# Altium schematic sheet 5_dc_dc_3V3_EPS_Beacon.SchDoc: EPS/BCM Step-Down Converter
size A4; DrawnBy: Sara V. Martínez; Engineer: Flight; DocumentNumber: 8; Revision: V0.1; SheetNumber: 8; SheetTotal: 11
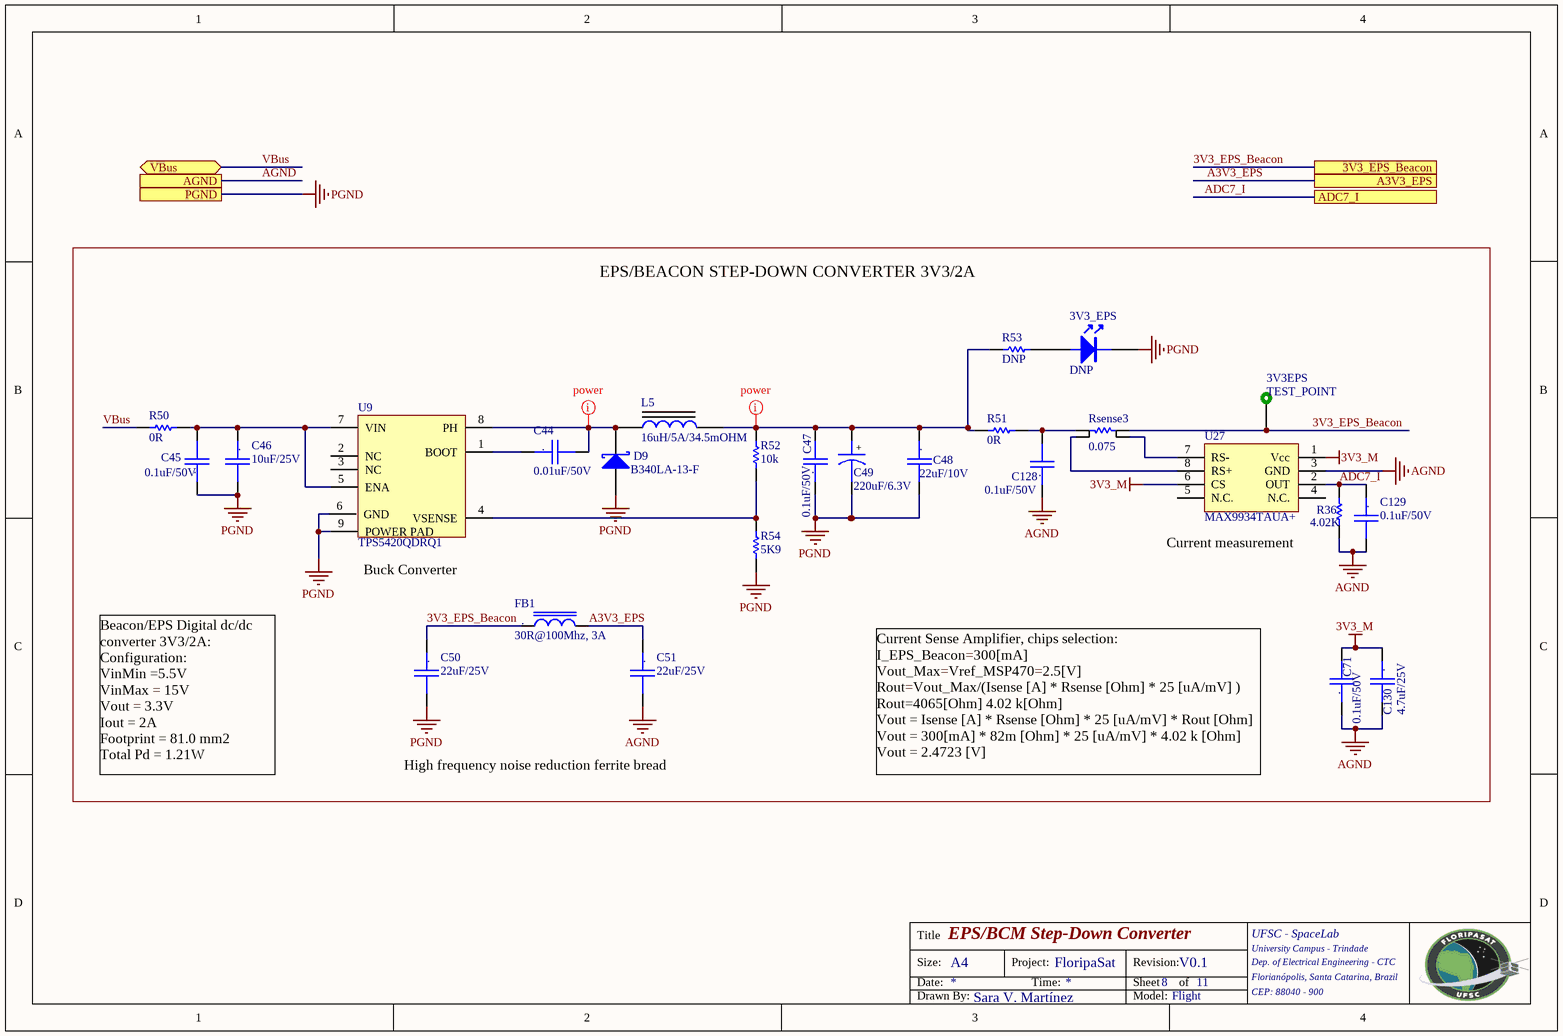
[diagram p0: 5_dc_dc_3V3_EPS_Beacon.SchDoc]

## Parts
3V3_EPS  DNP  [0603-LED]
3V3EPS  TEST_POINT  [TEST_POINT]  (no BOM)
C44  0.01uF/50V  [CC0805]
C45  0.1uF/50V  [CC0805]
C46  10uF/25V  [CC1206]
C47  0.1uF/50V  [CC0805]
C48  22uF/10V  [CC1206]
C49  220uF/6.3V  [cc1210]
C50  22uF/25V  [CC1210]
C51  22uF/25V  [CC1210]
C71  0.1uF/50V  [CC0603]
C128  0.1uF/50V  [CC0603]
C129  0.1uF/50V  [CC0603]
C130  4.7uF/25V  [CC0805]
D9  B340LA-13-F  [DO-214AC]
FB1  30R@100Mhz, 3A  [IND0805]
L5  16uH/5A/34.5mOHM  [IND_744325xxx]
R36  4.02K  [0805]
R50  0R  [1206]
R51  0R  [1206]
R52  10k  [0805]
R53  DNP  [0603]
R54  5K9  [0805]
Rsense3  0.075  [1206 - ohmite]
U9  TPS5420QDRQ1  [SO8 Power PAD]
U27  MAX9934TAUA+  [MSOP-8]

## Ports
3V3_EPS_Beacon, A3V3_EPS, ADC7_I, AGND, PGND, VBus (bidir)

## Nets
3V3_M: C71.2 C130.1 U27.1(Vcc) U27.6(CS)
AGND: C51.2 C71.1 C128.1 C129.2 C130.2 R36.1 U27.3(GND) ; port AGND
PGND: 3V3_EPS.2(K) C45.1 C46.2 C47.1 C48.2 C49.2 C50.2 D9.2(A) R54.1 U9.6(GND) U9.9(POWER_PAD) ; port PGND
3V3_EPS_Beacon: 3V3EPS.1 C50.1 FB1.1 Rsense3.2 ; port 3V3_EPS_Beacon
A3V3_EPS: C51.1 FB1.2 ; port A3V3_EPS
ADC7_I: C129.1 R36.2 U27.2(OUT) ; port ADC7_I
VBus: R50.2 ; port VBus
Net3V3_EPS_1: 3V3_EPS.1(A) R53.1
NetC44_1: C44.1 U9.1(BOOT)
NetC44_2: C44.2 D9.1(K) L5.1 U9.8(PH)
NetC45_2: C45.2 C46.1 R50.1 U9.5(ENA) U9.7(VIN)
NetC47_2: C47.2 C48.1 C49.1 L5.2 R51.2 R52.2 R53.2
NetC128_2: C128.2 R51.1 Rsense3.1
NetR52_1: R52.1 R54.2 U9.4(VSENSE)
NetRsense3_3: Rsense3.3 U27.8(RS+)
NetRsense3_4: Rsense3.4 U27.7(RS-)

Not connected (* = marked no-connect by the designer): U9 2(NC) 3(NC); U27 4(N.C.) 5(N.C.)

## Layout directives
net class power: NetC44_2, NetC47_2

## Notes on the sheet
- EPS/BEACON STEP-DOWN CONVERTER 3V3/2A
- (near U9) Buck Converter
- Current measurement
- Beacon/EPS Digital dc/dc converter 3V3/2A:
  Configuration:
  VinMin =5.5V
  VinMax = 15V
  Vout = 3.3V
  Iout = 2A
  Footprint = 81.0 mm2
  Total Pd = 1.21W
- High frequency noise reduction ferrite bread
- Current Sense Amplifier, chips selection:
  I_EPS_Beacon=300[mA]
  Vout_Max=Vref_MSP470=2.5[V]
  Rout=Vout_Max/(Isense [A] * Rsense [Ohm] * 25 [uA/mV] )
  Rout=4065[Ohm] 4.02 k[Ohm]
  Vout = Isense [A] * Rsense [Ohm] * 25 [uA/mV] * Rout [Ohm]
  Vout = 300[mA] * 82m [Ohm] * 25 [uA/mV] * 4.02 k [Ohm]
  Vout = 2.4723 [V]
- Title
- Size:
- Date:
- A4
- Project:
- Time:
- FloripaSat
- Revision:
- Sheet
- of
- UFSC - SpaceLab
- University Campus - Trindade
- Dep. of Electrical Engineering - CTC
- Florianópolis, Santa Catarina, Brazil
- Drawn By:
- Model:
- CEP: 88040 - 900
- (in symbol Cap_Cer_X7R_0.01uF_16V_1210) .
- (in symbol Cap_Cer_X7R_0.1uF_25V_0805) .
- (in symbol Cap_Cer_X7R_0.1uF_50V_0603) .
- (in symbol Cap_Cer_X7R_0.01uF_50V_0805) .
- (in symbol Cap_Cer_X7R_4.7uF_25V_0805) .
- (in symbol Cap_Cer_X7R_10uF_25V_1206) .
- (in symbol Cap_Cer_X7R_22uF_10V_1206) .
- (in symbol Cap_Tant_SMD_220uF_6.3V_1210) +
- (in symbol FB_30R_3A_100MHz_0805) .

## Library data of the parts
3V3_EPS = LED/G_0603: SMD Green LED; Partnumber: 150060VS75000; NCM: 8541.40.21
3V3EPS = TEST_POINT: Test point
C44 = Cap_Cer_X7R_0.01uF_50V_0805: CAP CER 0.01uF 50V 10% X7R 0805; Partnumber: GRM216R71H103KA01D; NCM: 8532.24.10
C45 C47 = Cap_Cer_X7R_0.1uF_25V_0805: CAP CER 0.1UF 50V 10% X7R 0805; Partnumber: GRM216R71H103KA01D; NCM: 8532.24.10
C46 = Cap_Cer_X7R_10uF_25V_1206: CAP CER 10uF 25V 10% X7R 1206; Partnumber: GRM31CR71E106KA12L; NCM: 8532.24.10
C48 = Cap_Cer_X7R_22uF_10V_1206: CAP CER 22uF 10V 10% X7R 1206; Partnumber: GRM31CR71A226KE15L; NCM: 8532.24.10
C49 = Cap_Tant_SMD_220uF_6.3V_1210: CAP Tantalum 220uF 6.3V 20% 1210; Partnumber: 6TPE220MAZB; NCM: 8532.21.11
C50 C51 = Cap_Cer_X7R_0.01uF_16V_1210: CAP CER 22uF 25V 10% X7R 1210; Partnumber: GRM32ER71E226KE15L; NCM: 8532.24.10
C71 C128 C129 = Cap_Cer_X7R_0.1uF_50V_0603: CAP CER 0.1UF 50V 10% X7R 0603; Partnumber: GRM188R71H104KA93D; NCM: 8532.24.10
C130 = Cap_Cer_X7R_4.7uF_25V_0805: CAP CER 4.7uF 25V 10% X7R 0805; Partnumber: GRM21BR71E475KA73L; NCM: 8532.24.10
D9 = DIODE_SCHOTTKY_40V_3A_B340LA-13-F: DIODE SCHOTTKY 40V 3A B340LA-13-F; NCM: 8541.10.29; Partnumber: B340LA-13-F
FB1 = FB_30R_3A_100MHz_0805: Ferrite Bead 30 OHM 3A 100MHz; Partnumber: BLM21PG300SN1D; NCM: 8504.50.00
L5 = IND_POWER_16uH_5A_35.5mR: INDUCTOR 16UH 5A SMD; Partnumber: 7443251600; NCM: 8504.50.00
R36 = R3.3k_0.1%_1/10W_0805: RES 3k3 OHM 1/10W 0.1% 0805; Partnumber: CPF0805B3K3E1; NCM: 8533.21.20
R50 R51 = R0R_JUMPER_1/2W_1206: RES 0.0 OHM 1/2W JUMP 1206; Partnumber: CRCW12060000Z0EAHP; NCM: 8533.21.20
R52 = R10k_1%_1/8W_0805: RES 10K OHM 1/8W 1%  0805; Partnumber: CRCW080510K0FKEA; NCM: 8533.21.20
R53 = R1.0k_1%_1/8W_0603: RES 1.0K OHM 1/8W 1% 0603; Partnumber: MCT06030C1001FP500; NCM: 8533.21.20
R54 = R5.9K_1%_1/8W_0805: RES 5K9 OHM 1/8W 1% 0805; Partnumber: 71-CRCW0805-5.9K-E3; NCM: 8533.21.20
Rsense3 = R0.05R_0.5%_0.5W_1206: Current Sense Resistors - SMD 0.05ohm .5% 4 Terminal; Partnumber: LVK12R050DER; NCM: 8533.21.20
U9 = TPS5420QDRQ1: Partnumber: TPS5420QDRQ1
U27 = MAX9934TAUA+: Partnumber: MAX9934TAUA+